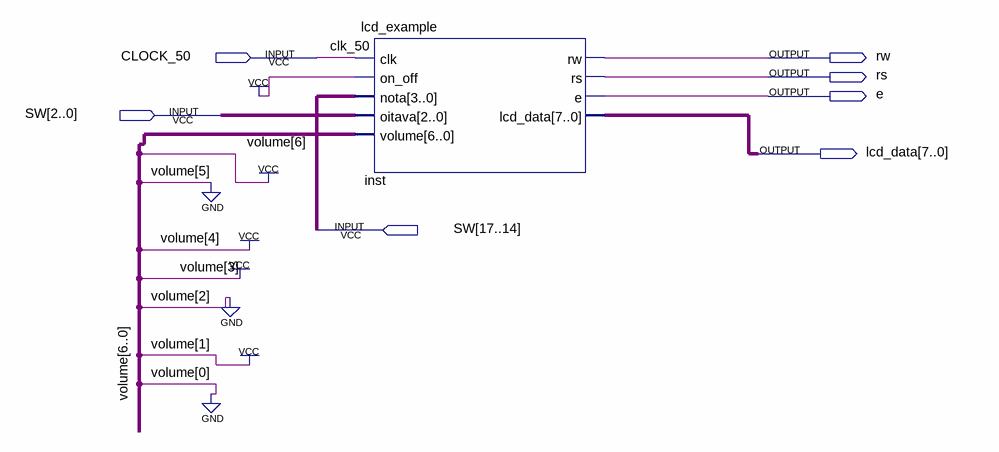
[diagram p0: schematic sheet]
// Quartus schematic teste_lcd.bdf as structural Verilog: 1 symbols, 7 pins
module teste_lcd (
  input  CLOCK_50,
  input  [17:0] SW,
  output rw,
  output rs,
  output e,
  output [7:0] lcd_data
);

  lcd_example inst (
    .clk(CLOCK_50), .on_off(1'b1), .nota(SW[17:14]), .oitava(SW[2:0]), .volume(7'b1011010), .rw(rw), .rs(rs),
    .e(e), .lcd_data(lcd_data));

  // Other names for the same wires on the sheet: clk_50 = CLOCK_50
endmodule
